# Altium schematic sheet VBAT_Output.SchDoc: =SheetTitle
size A4; SheetTitle: Protected VBAT Output; DrawnBy: Samyar Sadat Akhavi; SheetNumber: 9; SheetTotal: 19
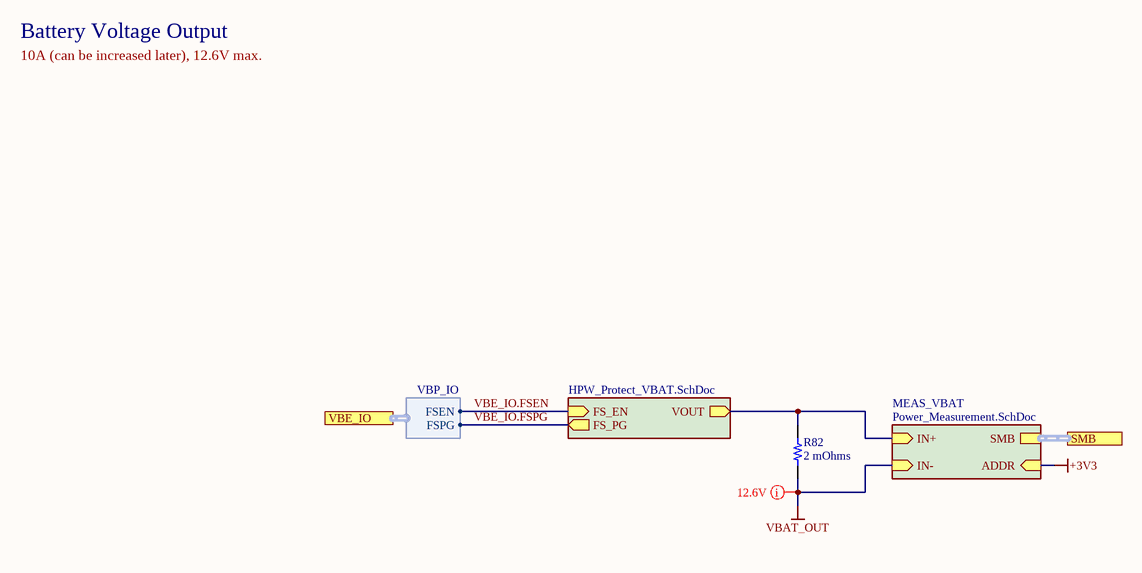
[diagram p0: VBAT_Output.SchDoc]

## Parts
?  (no value)  (graphical)
R82  2 mOhms  [STACKPOLE CSR2512]

## Sub-sheets
MEAS_VBAT = Power_Measurement.SchDoc: SMB (harness SMBus), ADDR (in), IN+ (in), IN- (in)
VBAT_OUT = HPW_Protect_VBAT.SchDoc: VOUT (out), FS_EN (in), FS_PG (out)

## Ports
SMB (harness SMBus, see Power_Board[3A], Battery_Input[4A], Power_Measurement[3B]), VBE_IO (harness VBP_IO, see Power_Board[3A], Microcontroller[4A])

## Harnesses
VBP_IO: FSEN, FSPG

## Nets
+3V3: sheet MEAS_VBAT/ADDR
VBAT_OUT: R82.1 ; sheet MEAS_VBAT/IN-
VBE_IO.FSEN: sheet VBAT_OUT/FS_EN, port VBE_IO.FSEN
VBE_IO.FSPG: sheet VBAT_OUT/FS_PG, port VBE_IO.FSPG
NetR82_2: R82.2 ; sheet MEAS_VBAT/IN+, sheet VBAT_OUT/VOUT

## Buses and harness runs
harness port SMB = sheet MEAS_VBAT/SMB

## Layout directives
rule Supply Nets [Voltage = 12.60]: VBAT_OUT

## Notes on the sheet
- Battery Voltage Output
- 10A (can be increased later), 12.6V max.
- Sub-Project:
- Size:
- Drawn By:
- Revision:
- Date:
- File:
- Sheet:
- of

## Library data of the parts
? = SGR-STDTBSA4: STANDARD SCHEMATICS TITLE BLOCK
R82 = TLR3A20DR002FTDG: RES 0.002 OHM 1% 2W 2512; Manufacturer: TE Connectivity Passive Product; Temperature Coefficient: ±50ppm/°C; Part Number: TLR3A20DR002FTDG; Package / Case: 2512 (6432 Metric); ComponentLink1Description: Datasheet; ComponentLink1URL: https://www.te.com/commerce/DocumentDelivery/DDEController?Action=srchrtrv&DocNm=1773449-3&DocType=DS&DocLang=English; ComponentLink2Description: DigiKey Link; ComponentLink2URL: http://digikey.com/product-detail/en/te-connectivity-passive-product/TLR3A20DR002FTDG/A129566CT-ND/8566770; Composition: Metal Foil; Device Package: 2512 (6432 Metric); Features: Current Sense; Height - Seated (Max): 0.024" (0.60mm); LastUpdated: 9/2/2020 1:18:06 AM; Lifecycle Status: Active; Minimum Order: 1; Number of Terminations: 2; Operating Temperature: -55°C ~ 170°C; Packaging: TapeAndReel; PartId: 1492; Part Status: Active; Power (Watts): 2W; Price: 0.30; Resistance: 2 mOhms; Series: TLR, CGS; Size / Dimension: 0.252" L x 0.126" W (6.40mm x 3.20mm); Supplier 1: DigiKey; Supplier Part Number 1: A129566CT-ND; Supplier Device Package: 2512; Tolerance: ±1%; Value: 2 mOhms